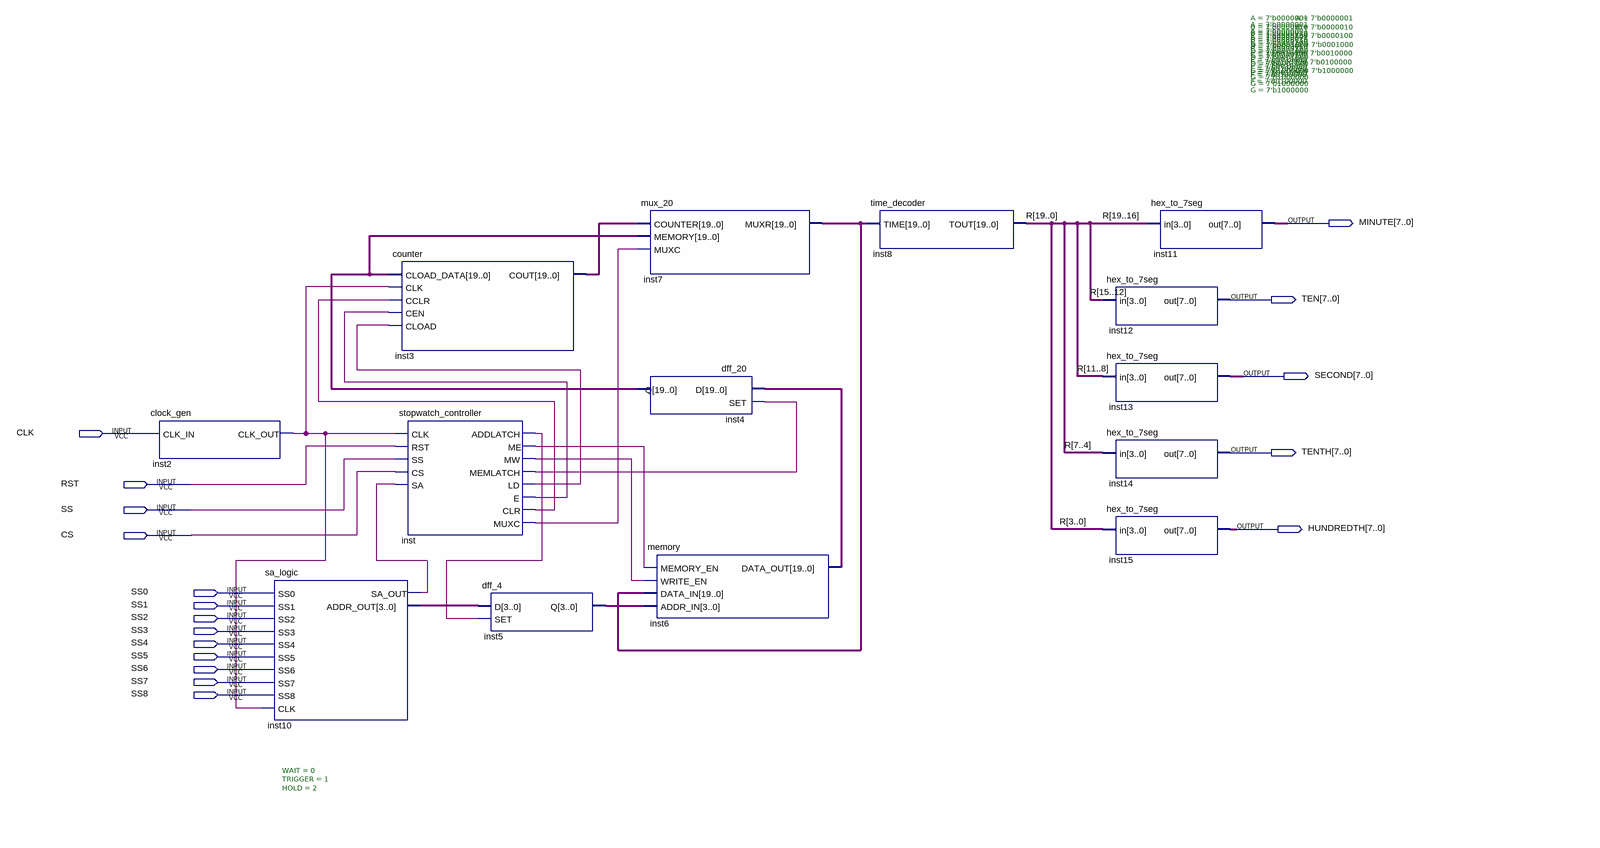
[diagram p0: schematic sheet]
// Quartus schematic LAB4.bdf as structural Verilog: 14 symbols, 18 pins
module LAB4 (
  input  CLK,
  input  RST,
  input  SS,
  input  CS,
  input  SS0,
  input  SS1,
  input  SS2,
  input  SS3,
  input  SS4,
  input  SS5,
  input  SS6,
  input  SS7,
  input  SS8,
  output [7:0] MINUTE,
  output [7:0] TEN,
  output [7:0] SECOND,
  output [7:0] TENTH,
  output [7:0] HUNDREDTH
);

  wire inst2_clk_out, inst10_sa_out, inst_addlatch, inst_clr, inst_e, inst_ld, inst_me, inst_memlatch,
       inst_muxc, inst_mw;
  wire [3:0] inst5_q, inst10_addr_out;
  wire [19:0] inst3_cout, inst4_q, inst6_data_out, inst7_muxr, R;

  clock_gen inst2 (.CLK_IN(CLK), .CLK_OUT(inst2_clk_out));
  sa_logic #(.WAIT(0), .TRIGGER(1), .HOLD(2)) inst10 (
    .SS0(SS0), .SS1(SS1), .SS2(SS2), .SS3(SS3), .SS4(SS4), .SS5(SS5), .SS6(SS6), .SS7(SS7), .SS8(SS8),
    .CLK(inst2_clk_out), .SA_OUT(inst10_sa_out), .ADDR_OUT(inst10_addr_out));
  counter inst3 (
    .CLOAD_DATA(inst4_q), .CLK(inst2_clk_out), .CCLR(inst_clr), .CEN(inst_e), .CLOAD(inst_ld),
    .COUT(inst3_cout));
  stopwatch_controller inst (
    .CLK(inst2_clk_out), .RST(RST), .SS(SS), .CS(CS), .SA(inst10_sa_out), .ADDLATCH(inst_addlatch),
    .ME(inst_me), .MW(inst_mw), .MEMLATCH(inst_memlatch), .LD(inst_ld), .E(inst_e), .CLR(inst_clr),
    .MUXC(inst_muxc));
  dff_4 inst5 (.D(inst10_addr_out), .SET(inst_addlatch), .Q(inst5_q));
  mux_20 inst7 (.COUNTER(inst3_cout), .MEMORY(inst4_q), .MUXC(inst_muxc), .MUXR(inst7_muxr));
  dff_20 inst4 (.D(inst6_data_out), .SET(inst_memlatch), .Q(inst4_q));
  memory inst6 (
    .MEMORY_EN(inst_me), .WRITE_EN(inst_mw), .DATA_IN(inst7_muxr), .ADDR_IN(inst5_q),
    .DATA_OUT(inst6_data_out));
  time_decoder inst8 (.TIME(inst7_muxr), .TOUT(R));
  hex_to_7seg #(.A(7'b0000001), .B(7'b0000010), .C(7'b0000100), .D(7'b0001000), .E(7'b0010000), .F(7'b0100000), .G(7'b1000000)) inst12 (
    .in(R[15:12]), .out(TEN));
  hex_to_7seg #(.A(7'b0000001), .B(7'b0000010), .C(7'b0000100), .D(7'b0001000), .E(7'b0010000), .F(7'b0100000), .G(7'b1000000)) inst13 (
    .in(R[11:8]), .out(SECOND));
  hex_to_7seg #(.A(7'b0000001), .B(7'b0000010), .C(7'b0000100), .D(7'b0001000), .E(7'b0010000), .F(7'b0100000), .G(7'b1000000)) inst14 (
    .in(R[7:4]), .out(TENTH));
  hex_to_7seg #(.A(7'b0000001), .B(7'b0000010), .C(7'b0000100), .D(7'b0001000), .E(7'b0010000), .F(7'b0100000), .G(7'b1000000)) inst15 (
    .in(R[3:0]), .out(HUNDREDTH));
  hex_to_7seg #(.A(7'b0000001), .B(7'b0000010), .C(7'b0000100), .D(7'b0001000), .E(7'b0010000), .F(7'b0100000), .G(7'b1000000)) inst11 (
    .in(R[19:16]), .out(MINUTE));
endmodule
